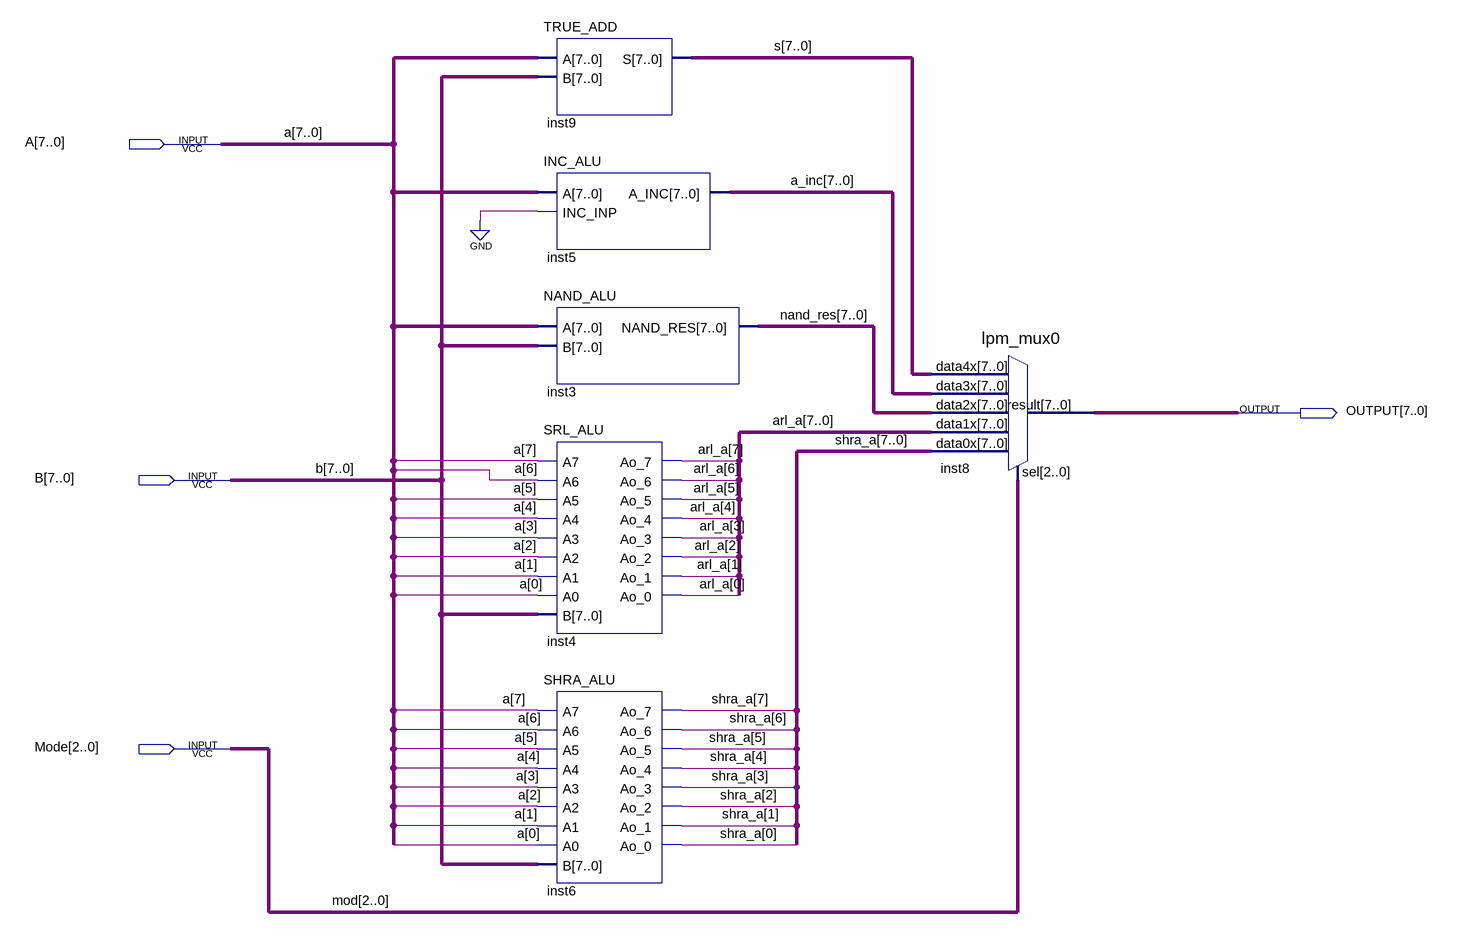
[diagram p0: schematic sheet]
// Quartus schematic ALU.bdf as structural Verilog: 6 symbols, 4 pins
module ALU (
  input  [7:0] A,
  input  [7:0] B,
  input  [2:0] Mode,
  output [7:0] OUTPUT
);

  wire [7:0] a_inc, arl_a, nand_res, s, shra_a;

  TRUE_ADD inst9 (.A(A), .B(B), .S(s));
  INC_ALU inst5 (.A(A), .INC_INP(1'b0), .A_INC(a_inc));
  NAND_ALU inst3 (.A(A), .B(B), .NAND_RES(nand_res));
  SRL_ALU inst4 (
    .A7(A[7]), .A6(A[6]), .A5(A[5]), .A4(A[4]), .A3(A[3]), .A2(A[2]), .A1(A[1]), .A0(A[0]), .B(B),
    .Ao_7(arl_a[7]), .Ao_6(arl_a[6]), .Ao_5(arl_a[5]), .Ao_4(arl_a[4]), .Ao_3(arl_a[3]), .Ao_2(arl_a[2]),
    .Ao_1(arl_a[1]), .Ao_0(arl_a[0]));
  SHRA_ALU inst6 (
    .A7(A[7]), .A6(A[6]), .A5(A[5]), .A4(A[4]), .A3(A[3]), .A2(A[2]), .A1(A[1]), .A0(A[0]), .B(B),
    .Ao_7(shra_a[7]), .Ao_6(shra_a[6]), .Ao_5(shra_a[5]), .Ao_4(shra_a[4]), .Ao_3(shra_a[3]),
    .Ao_2(shra_a[2]), .Ao_1(shra_a[1]), .Ao_0(shra_a[0]));
  lpm_mux0 inst8 (
    .data4x(s), .data3x(a_inc), .data2x(nand_res), .data1x(arl_a), .data0x(shra_a), .sel(Mode),
    .result(OUTPUT));

  // Other names for the same wires on the sheet: mod[2:0] = Mode
endmodule
